# Altium schematic sheet input.SCHDOC
size B
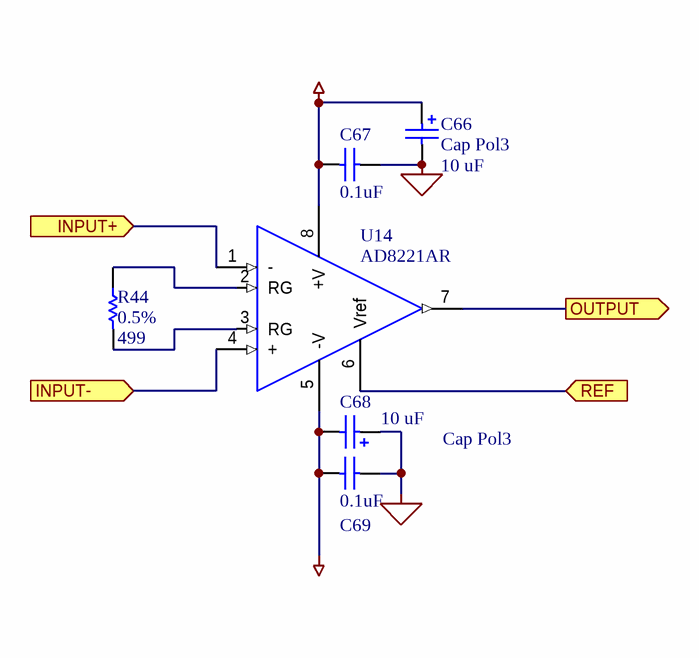
[diagram p0: input.SCHDOC]

## Parts
C66  Cap Pol3  value 10 uF  [TC3216-1206]
C67  value 0.1uF  [CC1608-0603]  (hidden comment: Cap)
C68  Cap Pol3  value 10 uF  [TC3216-1206]
C69  value 0.1uF  [CC1608-0603]  (hidden comment: Cap)
R44  0.5%  value 499  [R2012-0805]
U14  AD8221AR  [SO-G8]

## Ports
INPUT+ (in), INPUT- (in), OUTPUT (out), REF (in)

## Nets
AGND: C66.2 C67.2 C68.1 C69.2
AVDD: C66.1 C67.1 U14.8(+V)
AVSS: C68.2 C69.1 U14.5(-V)
INPUT+: U14.1(-) ; port INPUT+
INPUT-: U14.4(+) ; port INPUT-
OUTPUT: U14.7(Vout) ; port OUTPUT
REF: U14.6(Vref) ; port REF
NetR44_1: R44.1 U14.2(RG)
NetR44_2: R44.2 U14.3(RG)

## Library data of the parts
C66 C68 = Cap Pol3: Polarized Capacitor (Surface Mount); Manufacturer: Generic Components; Class I: Passive; Published: 8-Jun-2000; Revision: July-2002: Re-released for DXP Platform.; Publisher: Altium Limited; Class II: Capacitor
C67 C69 = Cap: Capacitor; Manufacturer: Generic Components; Class I: Passive; Published: 8-Jun-2000; Revision: July-2002: Re-released for DXP Platform.; Publisher: Altium Limited; Class II: Capacitor
R44 = Res1: RR1220P-4990-D-M; Manufacturer: Generic Components; Class I: Passive; Class II: Resistor; Published: 8-Jun-2000; Revision: July-2002: Re-released for DXP Platform.; Publisher: Altium Limited
U14 = AD8221: AD8221 Precision Instrumentation Amplifier